# Altium schematic sheet MCU.SchDoc: BLE MCU Sub-board
size Letter; Author: John Kelley; CompanyName: Hello, Inc.; DrawnBy: John Kelley; Engineer: John Kelley; Organization: Hello, Inc.; Address1: 1660 17th St; Address2: San Francisco, CA; Address3: 94107; Address4: http://www.sayhello.com; DocumentNumber: 2; Revision: EVT2; SheetNumber: 2; SheetTotal: 8; DocumentName: BLE MCU Sub-board; ProjectName: Hello Band
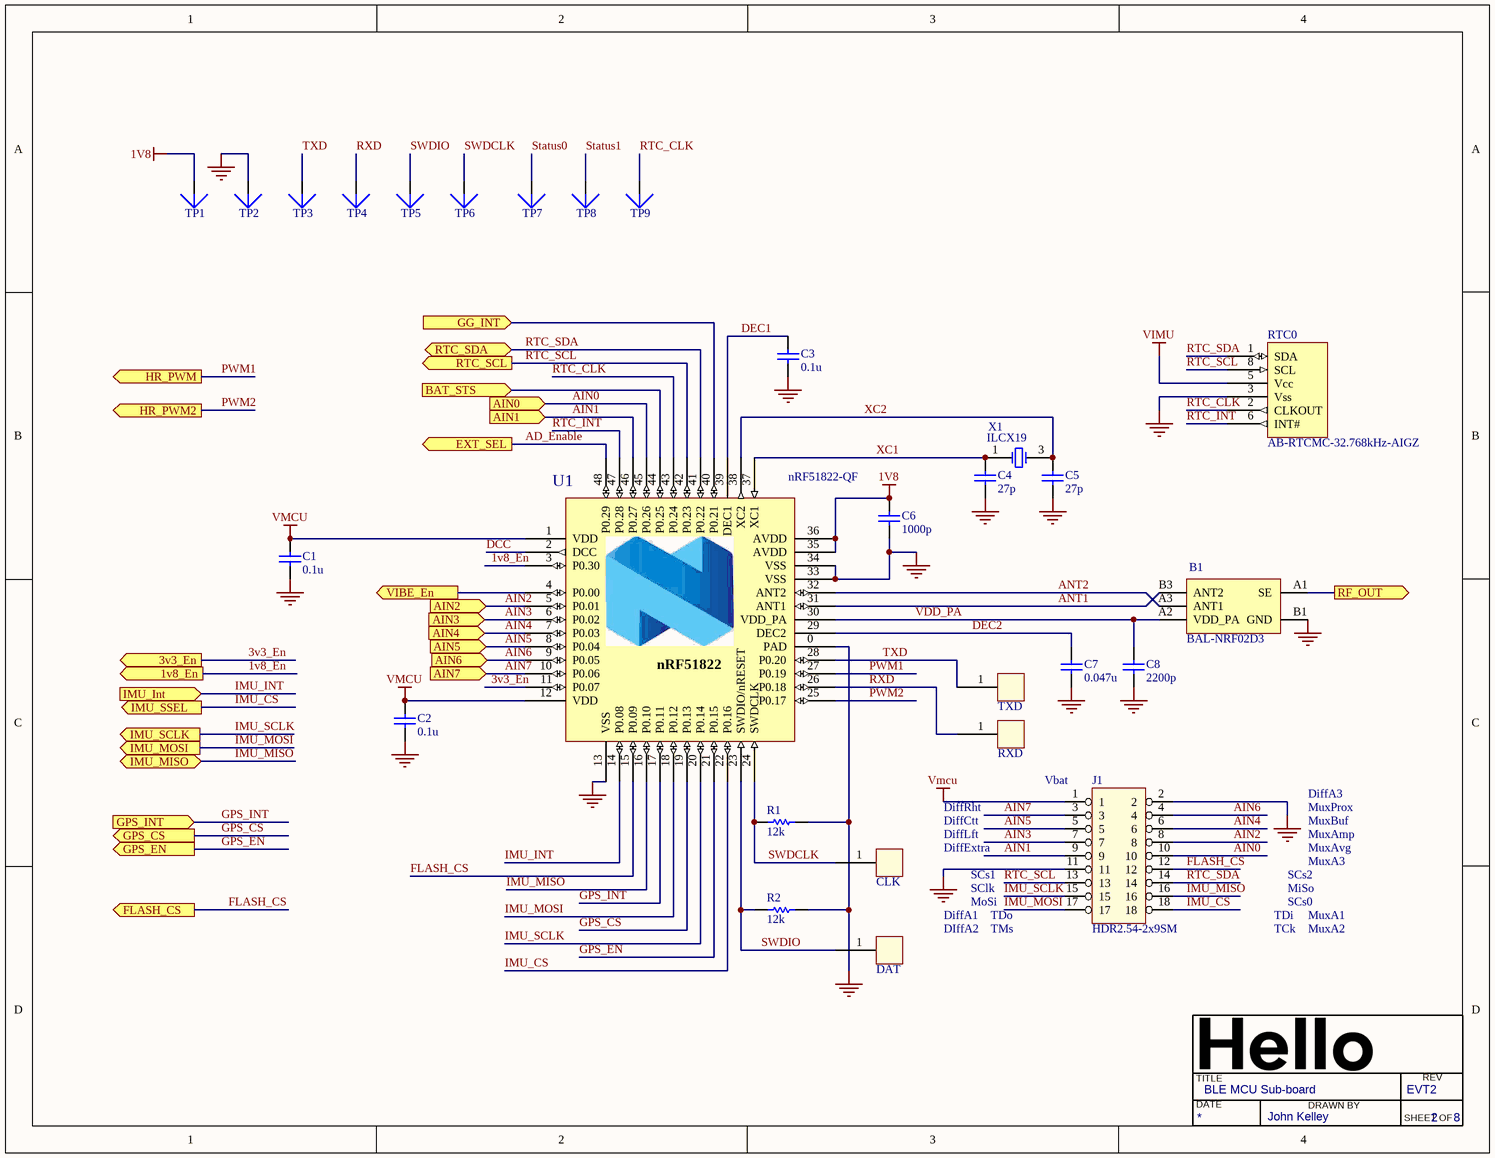
[diagram p0: MCU.SchDoc]

## Parts
B1  BAL-NRF02D3  [BAL-ST-WLCSP]
C1  0.1u  [CAP0201]
C2  0.1u  [CAP0201]
C3  0.1u  [CAP0201]
C4  27p  [CAP0201]
C5  27p  [CAP0201]
C6  1000p  [CAP0201]
C7  0.047u  [CAP0402]
C8  2200p  [CAP0402]
CLK  5016  [TP0875x050]  (value not drawn)
DAT  5016  [TP0875x050]  (value not drawn)
J1  HDR2.54-2x9SM  [HDR2.54-2X9]
R1  12k  [RES0402]
R2  12k  [RES0402]
RTC0  AB-RTCMC-32.768kHz-AIGZ  [8-CLCC]
RXD  5016  [TP0875x050]  (value not drawn)
TP1  TestPoint  [TP-0.3]  (value not drawn)
TP2  TestPoint  [TP-0.3]  (value not drawn)
TP3  TestPoint  [TP-0.3]  (value not drawn)
TP4  TestPoint  [TP-0.3]  (value not drawn)
TP5  TestPoint  [TP-0.3]  (value not drawn)
TP6  TestPoint  [TP-0.3]  (value not drawn)
TP7  TestPoint  [TP-0.3]  (value not drawn)
TP8  TestPoint  [TP-0.3]  (value not drawn)
TP9  TestPoint  [TP-0.3]  (value not drawn)
TXD  5016  [TP0875x050]  (value not drawn)
U1  nRF51822-QF  [VQFN40P600X600X100-48]
X1  ILCX19  [ILCX19]

## Ports
1v8_En (out), 3v3_En (out), AIN0 (in), AIN1 (in), AIN2 (in), AIN3 (in), AIN4 (in), AIN5 (in), AIN6 (in), AIN7 (in), BAT_STS (in), EXT_SEL (out), FLASH_CS (out), GG_INT (in), GPS_CS (out), GPS_EN (out), GPS_INT (in), HR_PWM2 (out), HR_PWM (out), IMU_Int (in), IMU_MISO, IMU_MOSI (out), IMU_SCLK (out), IMU_SSEL (out), RF_OUT (out), RTC_SCL (out), RTC_SDA, VIBE_En (out)

## Nets
1V8: C6.2 TP1.1 U1.35(AVDD) U1.36(AVDD)
GND: B1.B1(GND) C1.1 C2.1 C3.1 C4.1 C5.1 C6.1 C7.1 C8.1 J1.2 J1.11 R1.2 R2.2 RTC0.3(Vss) TP2.1 U1.0(PAD) U1.13(VSS) U1.33(VSS) U1.34(VSS)
VIMU: RTC0.5(Vcc)
VMCU: C1.2 C2.2 J1.1 U1.1(VDD) U1.12(VDD)
1v8_En: U1.3(P0.30) ; port 1v8_En
3v3_En: U1.11(P0.07) ; port 3v3_En
AD_Enable: U1.48(P0.29) ; port EXT_SEL
AIN0: J1.10 U1.45(P0.26) ; port AIN0
AIN1: J1.9 U1.46(P0.27) ; port AIN1
AIN2: J1.8 U1.5(P0.01) ; port AIN2
AIN3: J1.7 U1.6(P0.02) ; port AIN3
AIN4: J1.6 U1.7(P0.03) ; port AIN4
AIN5: J1.5 U1.8(P0.04) ; port AIN5
AIN6: J1.4 U1.9(P0.05) ; port AIN6
AIN7: J1.3 U1.10(P0.06) ; port AIN7
ANT1: B1.B3(ANT2) U1.31(ANT1)
ANT2: B1.A3(ANT1) U1.32(ANT2)
BAT_STS: U1.44(P0.25) ; port BAT_STS
DCC: U1.2(DCC)
DEC1: C3.2 U1.39(DEC1)
DEC2: C7.2 U1.29(DEC2)
FLASH_CS: J1.12 U1.15(P0.09) ; port FLASH_CS
GG_INT: U1.40(P0.21) ; port GG_INT
GPS_CS: U1.19(P0.13) ; port GPS_CS
GPS_EN: U1.21(P0.15) ; port GPS_EN
GPS_INT: U1.17(P0.11) ; port GPS_INT
IMU_CS: J1.18 U1.22(P0.16) ; port IMU_SSEL
IMU_INT: U1.14(P0.08) ; port IMU_Int
IMU_MISO: J1.16 U1.16(P0.10) ; port IMU_MISO
IMU_MOSI: J1.17 U1.18(P0.12) ; port IMU_MOSI
IMU_SCLK: J1.15 U1.20(P0.14) ; port IMU_SCLK
PWM1: U1.27(P0.19) ; port HR_PWM
PWM2: U1.25(P0.17) ; port HR_PWM2
RF_OUT: B1.A1(SE) ; port RF_OUT
RTC_CLK: RTC0.2(CLKOUT) TP9.1 U1.43(P0.24)
RTC_INT: RTC0.6(INT#) U1.47(P0.28)
RTC_SCL: J1.13 RTC0.8(SCL) U1.42(P0.23) ; port RTC_SCL
RTC_SDA: J1.14 RTC0.1(SDA) U1.41(P0.22) ; port RTC_SDA
RXD: RXD.1 TP4.1 U1.26(P0.18)
Status0: TP7.1
Status1: TP8.1
SWDCLK: CLK.1 R1.1 TP6.1 U1.24(SWDCLK)
SWDIO: DAT.1 R2.1 TP5.1 U1.23(SWDIO/nRESET)
TXD: TP3.1 TXD.1 U1.28(P0.20)
VDD_PA: B1.A2(VDD_PA) C8.2 U1.30(VDD_PA)
VIBE_En: U1.4(P0.00) ; port VIBE_En
XC1: C4.2 U1.37(XC1) X1.1(XTAL1)
XC2: C5.2 U1.38(XC2) X1.3(XTAL2)

Not connected (* = marked no-connect by the designer): RTC0 4(NC) 7(NC)

## Notes on the sheet
- DiffRht
- DiffCtt
- DiffLft
- (near J1) Vbat
- DiffA3
- MuxProx
- MuxBuf
- MuxAmp
- DiffExtra
- SCs1
- SClk
- MoSi
- SCs2
- SCs0
- MiSo
- MuxAvg
- MuxA3
- DIffA2
- DiffA1
- TDo
- TMs
- TDi
- TCk
- MuxA2
- MuxA1
- TITLE
- DATE
- DRAWN BY
- REV
- SHEET
- OF
- (in symbol nRF51822_QF) nRF51822

## Library data of the parts
B1 = BAL-ST-5pin_DC-Flip: 50 ohm balun transformer for 2.45GHz ISM; Manufacturer: ST; Artikkelnr Noca: N.A.; Part Number: BAL-NRF02D3; Manufacturer Part Number: BAL-NRF02D3; Datasheet: *; LatestRevisionDate: 2013-05-15; Pin Count: 5; Publisher: Nordic Semiconductor; Published: 2013-05-15; Value: BAL-NRF02D3; Note: BAL-NRF02D3; Supplier: *; Supplier part number: *; 2nd source Supplier: *; 2nd source part number: *
C1-C3 = C_0.1u_10_10_X5R_0201: Chip capacitor; Vendor: Taiyo Yuden; PN: LMK063BJ104KP-F; Tolerance: 10%; Voltage: 10V; Temp: X5R; Value: 0.1u; Size: 0201
C4 C5 = C_27p_5_50_C0G_0201: Chip capacitor; Vendor: Taiyo Yuden; PN: UMK063CG270JT-F; Tolerance: 5 %; Voltage: 50V; Temp: C0G; Value: 27p; Size: 0201
C6 = C_1000p_10_25_X7R_0201: Chip capacitor; Vendor: Taiyo Yuden; PN: TMK063B7102KP-F; Tolerance: 10%; Voltage: 25V; Temp: X7R; Value: 1000p; Size: 0201
C7 = C_0.047u_10_16_X7R_0402: Chip capacitor; Vendor: Taiyo Yuden; PN: EMK105B7473KV-F; Tolerance: 10%; Voltage: 16V; Temp: X7R; Value: 0.047u; Size: 0402
C8 = C_2200p_5_16_STD_0402: Chip capacitor; Vendor: Taiyo Yuden; PN: EMK105SD222JV-F; Tolerance: 5 %; Voltage: 16V; Temp: Standard; Value: 2200p; Size: 0402
CLK DAT RXD TXD = 5016: Single-pad test point
R1 R2 = R_12k_0.5_0.063_0402: Chip Resistor; Vendor: Panasonic; Tolerance: 0.5 %; Power: 0.063 W; PN: ERA-2AED123X; Model: *; Value: 12k; Size: 0402
RTC0 = AB-RTCMC-32.768kHz-AIGZ: Abracon I2C RTC w/ integrated XO
TP1-TP9 = TestPoint: Generic Test Point
U1 = nRF51822_QF: Multi-protocol Bluetooth Low Energy and 2.4GHz proprietary system-on-chip; Manufacturer: Nordic Semiconductor; Note: nRF51822 - VQFN48 6x6 0.4mm pitch; Artikkelnr Noca: N.A.; Part Number: nRF51822-QF; Manufacturer Part Number: nRF51822-QF; Datasheet: *; Footprint: VQFN48; LatestRevisionDate: 2013-04-10; Pin Count: 48; Publisher: Nordic Semiconductor; Published: 2012-06-12; Value: nRF51822-QF; Supplier: Nordic Semiconductor; Supplier part number: *; 2nd source Supplier: *; 2nd source part number: *
X1 = ILCX19: ILSI ILCX19 Crystal Oscillator